# Altium schematic sheet Microcontroller.SchDoc
size A4; SheetNumber: 2; SheetTotal: 10
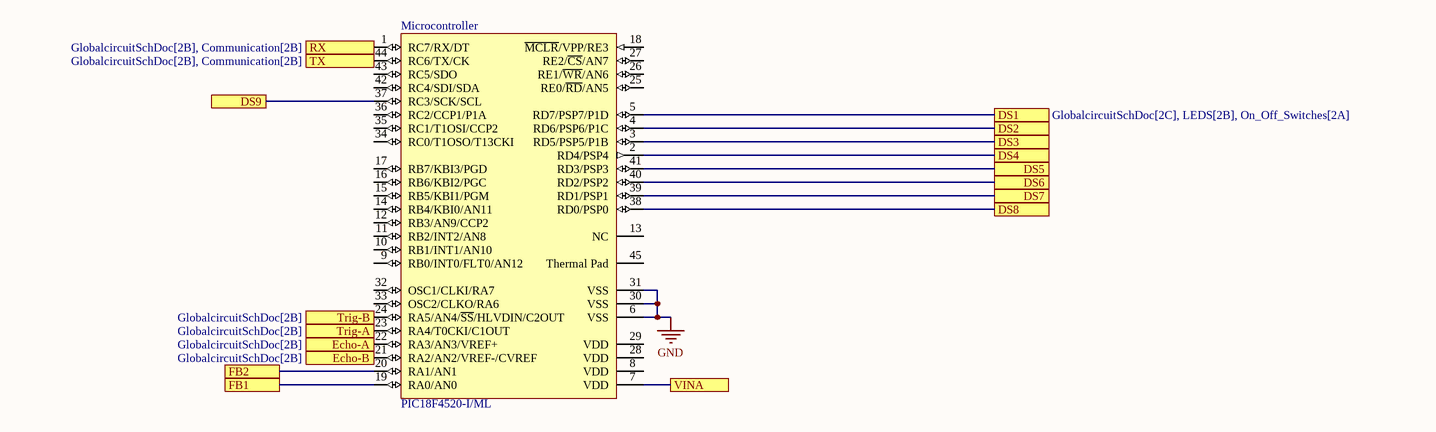
[diagram p0: Microcontroller.SchDoc]

## Parts
Microcontroller  PIC18F4520-I/ML  [QFN-ML44_L]

## Ports
DS1 (see GlobalcircuitSchDoc[2C], LEDS[2B], On_Off_Switches[2A]), DS2 (see GlobalcircuitSchDoc[2C], LEDS[2B], On_Off_Switches[2A]), DS3 (see GlobalcircuitSchDoc[2C], LEDS[2B], On_Off_Switches[3A]), DS4 (see GlobalcircuitSchDoc[2C], LEDS[2B], On_Off_Switches[4A]), DS5 (see GlobalcircuitSchDoc[2C], LEDS[2B], On_Off_Switches[4A]), DS6 (see GlobalcircuitSchDoc[2C], LEDS[2B], On_Off_Switches[3B]), DS7 (see GlobalcircuitSchDoc[2C], LEDS[3B], On_Off_Switches[4B]), DS8 (see GlobalcircuitSchDoc[2B], LEDS[3B], On_Off_Switches[4B]), DS9 (see GlobalcircuitSchDoc[2B], LEDS[3B], On_Off_Switches[4C]), Echo-A (see GlobalcircuitSchDoc[2B]), Echo-B (see GlobalcircuitSchDoc[2B]), FB1 (see GlobalcircuitSchDoc[1C], Probe_Switches[2B]), FB2 (see GlobalcircuitSchDoc[1C], Probe_Switches[2C]), RX (see GlobalcircuitSchDoc[2B], Communication[2B]), Trig-A (see GlobalcircuitSchDoc[2B]), Trig-B (see GlobalcircuitSchDoc[2B]), TX (see GlobalcircuitSchDoc[2B], Communication[2B]), VINA (see GlobalcircuitSchDoc[1C], Communication[3B], InputSockets[2B], Probe_Switches[2B], Probe_Switches[2C], Source_and_regulation[3B])

## Nets
GND: Microcontroller.6(VSS) Microcontroller.30(VSS) Microcontroller.31(VSS)
DS1: Microcontroller.5(RD7/PSP7/P1D) ; port DS1
DS2: Microcontroller.4(RD6/PSP6/P1C) ; port DS2
DS3: Microcontroller.3(RD5/PSP5/P1B) ; port DS3
DS4: Microcontroller.2(RD4/PSP4) ; port DS4
DS5: Microcontroller.41(RD3/PSP3) ; port DS5
DS6: Microcontroller.40(RD2/PSP2) ; port DS6
DS7: Microcontroller.39(RD1/PSP1) ; port DS7
DS8: Microcontroller.38(RD0/PSP0) ; port DS8
DS9: Microcontroller.37(RC3/SCK/SCL) ; port DS9
Echo-A: Microcontroller.22(RA3/AN3/VREF+) ; port Echo-A
Echo-B: Microcontroller.21(RA2/AN2/VREF-/CVREF) ; port Echo-B
FB1: Microcontroller.19(RA0/AN0) ; port FB1
FB2: Microcontroller.20(RA1/AN1) ; port FB2
RX: Microcontroller.1(RC7/RX/DT) ; port RX
Trig-A: Microcontroller.23(RA4/T0CKI/C1OUT) ; port Trig-A
Trig-B: Microcontroller.24(RA5/AN4/~{SS}/HLVDIN/C2OUT) ; port Trig-B
TX: Microcontroller.44(RC6/TX/CK) ; port TX
VINA: Microcontroller.7(VDD) ; port VINA

Not connected (* = marked no-connect by the designer): Microcontroller 8(VDD) 9(RB0/INT0/FLT0/AN12) 10(RB1/INT1/AN10) 11(RB2/INT2/AN8) 12(RB3/AN9/CCP2) 13(NC) 14(RB4/KBI0/AN11) 15(RB5/KBI1/PGM) 16(RB6/KBI2/PGC) 17(RB7/KBI3/PGD) 18(~{MCLR}/VPP/RE3) 25(RE0/~{RD}/AN5) 26(RE1/~{WR}/AN6) 27(RE2/~{CS}/AN7) 28(VDD) 29(VDD) 32(OSC1/CLKI/RA7) 33(OSC2/CLKO/RA6) 34(RC0/T1OSO/T13CKI) 35(RC1/T1OSI/CCP2) 36(RC2/CCP1/P1A) 42(RC4/SDI/SDA) 43(RC5/SDO) 45(Thermal_Pad)

## Library data of the parts
Microcontroller = CMP-0116-00437-1: Enhanced Flash Microcontroller with 10-Bit A/D and nanoWatt Technology, 32K Flash, 44-Pin QFN, Industrial Temperature Range; PackageDescription: 44-Lead Plastic Quad Flat, No Lead Package (ML) - 8x8 mm Body [QFN]; Code_JEDEC: MO-220; PackageReference: QFN-ML44; DatasheetVersion: revE, Oct-2008; Code_IPC: QFN65P800X800-44V2; PackageVersion: revBB, Aug-2009